# Altium schematic sheet Thermostat.SchDoc: Schématique Carte Thermostat
size A4; Date: 16/12/2024; Author: Randonnet Bertil; Revision: V1REVA; SheetNumber: 1; SheetTotal: 1
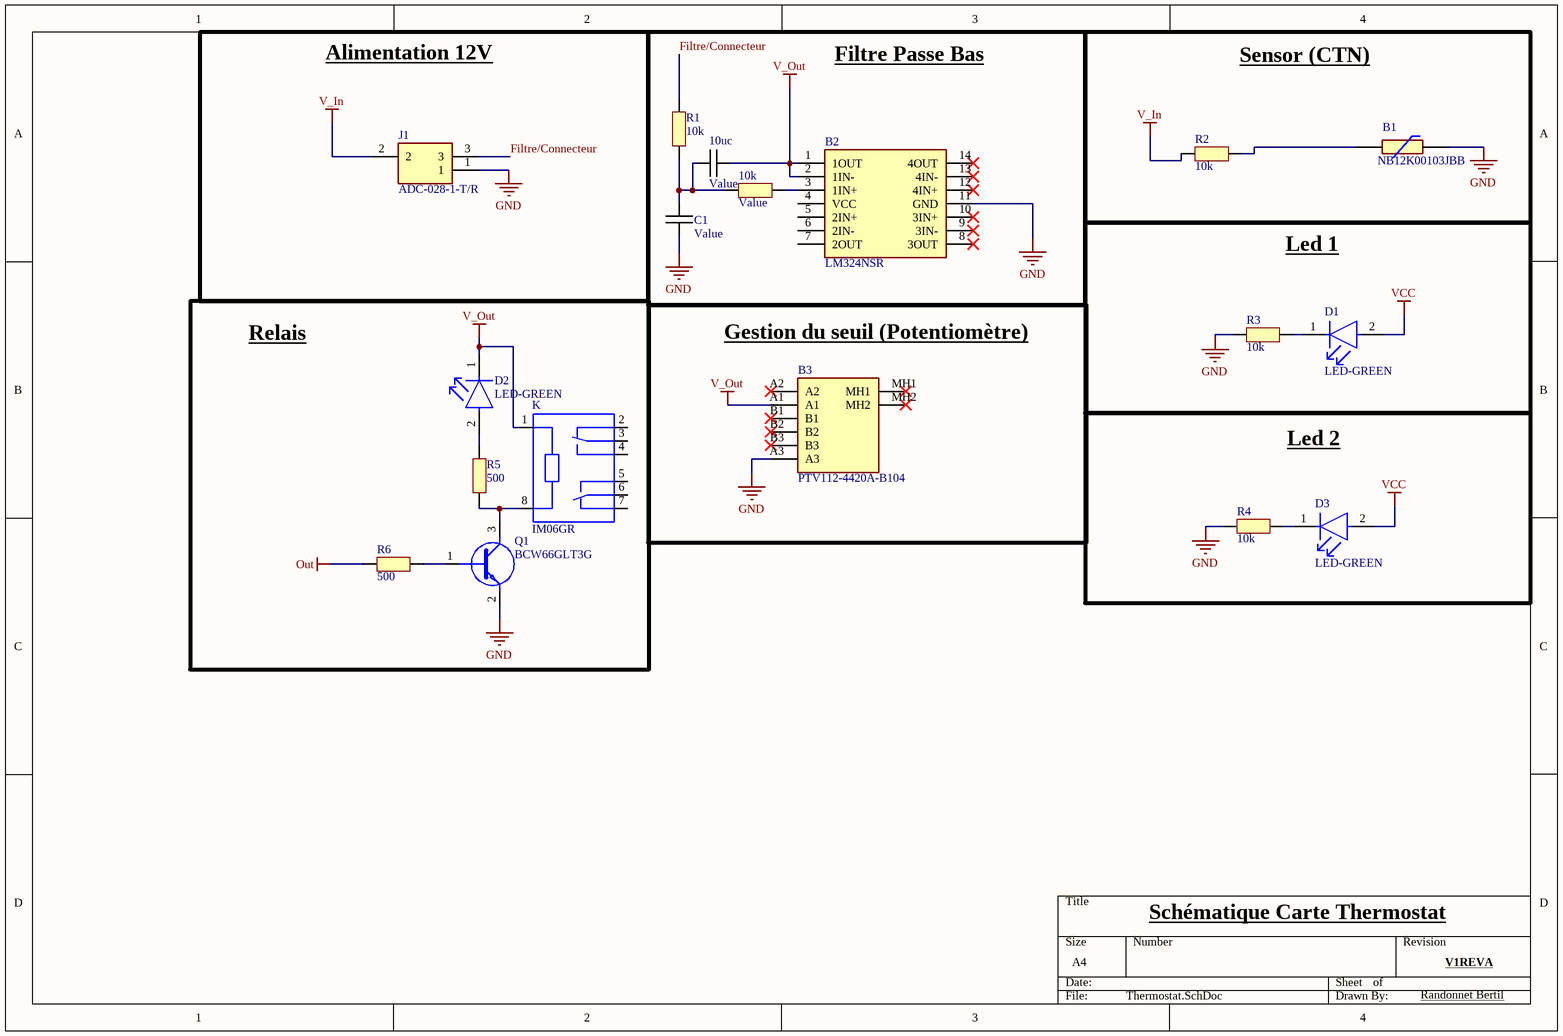
[diagram p0: Thermostat.SchDoc]

## Parts
10k  Value  [RESC1005X06N]
10uc  Value  [CAPC1005X06N]
B1  NB12K00103JBB  [RESC2212X50N]
B2  LM324NSR  [SOIC127P780X200-14N]
B3  PTV112-4420A-B104  [PTV1124420AB104]
C1  Value  [CAPC1005X06N]
D1  LED-GREEN  [SMD-1608-LED]
D2  LED-GREEN  [SMD-1608-LED]
D3  LED-GREEN  [SMD-1608-LED]
J1  ADC-028-1-T/R  [PJ1021SMTTR]
K  IM06GR  [RELAY_IM06GR]
Q1  BCW66GLT3G  [SOT96P237X111-3N]
R1  10k  [RESC1005X06N]
R2  10k  [RESC1005X06N]
R3  10k  [RESC1005X06N]
R4  10k  [RESC1005X06N]
R5  500  [RESC1005X06N]
R6  500  [RESC1005X06N]

## Blocks framed on the sheet
Alimentation 12V: J1
Filtre Passe Bas: 10k 10uc B2 C1 R1
Sensor (CTN): B1 R2
Led 1: D1 R3
Relais: D2 K Q1 R5 R6
Gestion du seuil (Potentiomètre): B3
Led 2: D3 R4

## Nets
GND: B1.1 B2.11(GND) B3.A3 C1.2 J1.1 Q1.2(E) R3.2 R4.2
Out: R6.2
V_In: J1.2 R2.1
V_Out: 10uc.2 B2.1(1OUT) B2.2(1IN-) B3.A1 D2.1(C) K.1
VCC: D1.2(A) D3.2(A)
Filtre/Connecteur: J1.3 R1.2
Net10k_1: 10k.1 10uc.1 C1.1 R1.1
Net10k_2: 10k.2 B2.3(1IN+)
NetB1_2: B1.2 R2.2
NetD1_1: D1.1(C) R3.1
NetD2_2: D2.2(A) R5.2
NetD3_1: D3.1(C) R4.1
NetK_8: K.8 Q1.3(C) R5.1
NetQ1_1: Q1.1(B) R6.1

Not connected (* = marked no-connect by the designer): B2 4(VCC) 5(2IN+) 6(2IN-) 7(2OUT) 8(3OUT)* 9(3IN-)* 10(3IN+)* 12(4IN+)* 13(4IN-)* 14(4OUT)*; B3 A2* B1* B2* B3* MH1* MH2*; K 2 3 4 5 6 7

## Library data of the parts
10k R1-R6 = Resistor
10uc C1 = Capacitor
B1 = NB12K00103JBB: NTC SMD Thermistor, NB12K, 10K, 5% AVX 10k 0805 Protection NTC Thermistor, 5s, 2 x 1.25 x 1.3mm; Manufacturer_Name: Kyocera AVX; Geometry.Height: 0.5mm; Manufacturer_Part_Number: NB12K00103JBB; Mouser Part Number: 581-NB12K00103JBB; Mouser Price/Stock: https://www.mouser.co.uk/ProductDetail/AVX/NB12K00103JBB/?qs=4%252B6%252BTdINQeDPvI%252BQUQjJ3Q%3D%3D; Arrow Part Number: NB12K00103JBB; Arrow Price/Stock: https://www.arrow.com/en/products/nb12k00103jbb/avx; Datasheet Link: https://datasheet.datasheetarchive.com/originals/distributors/Datasheets-DGA6/551314.pdf
B2 = LM324NSR: Quadruple Operational Amplifier; Manufacturer_Name: Texas Instruments; Geometry.Height: 2mm; Manufacturer_Part_Number: LM324NSR; Mouser Part Number: 595-LM324NSR; Mouser Price/Stock: https://www.mouser.co.uk/ProductDetail/Texas-Instruments/LM324NSR?qs=VBduBm9rCJQcjq4eh95DkA%3D%3D; Arrow Part Number: LM324NSR; Arrow Price/Stock: https://www.arrow.com/en/products/lm324nsr/texas-instruments?utm_currency=USD&region=nac; Datasheet Link: http://www.ti.com/lit/gpn/LM324
B3 = PTV112-4420A-B104: Potentiometers PANEL CONTROL 100kOhm; Manufacturer_Name: Bourns; Geometry.Height: 20.5mm; Manufacturer_Part_Number: PTV112-4420A-B104; Mouser Part Number: 652-PTV1124420AB104; Mouser Price/Stock: https://www.mouser.co.uk/ProductDetail/Bourns/PTV112-4420A-B104?qs=nqw9FAyaR8PT4wHHFlLdhA%3D%3D; Arrow Part Number: *; Arrow Price/Stock: *; Datasheet Link: https://www.bourns.com/docs/Product-Datasheets/PTVPTT.pdf
D1-D3 = LED-GREEN: LED GREEN CLEAR CHIP SMD LTST-C190GKT; Dominant Wavelength: 569nm; Reverse Voltage: 5V; Lens Color: Colorless; Viewing Angle: 130°; Voltage: 2V; Forward Current: 30mA; Power Dissipation: 100mW; Luminous Intensity: 6mcd; Number of LEDs: 1; Forward Voltage: 2.1V; Wavelength: 565nm; Test Current: 10mA; Min Operating Temperature: -55°C; Lens Style: Clear; Mount: Surface Mount; Width: 0.8mm; Packaging: Tape and Reel; Lens Transparency: Clear; Case Code (Metric): 1608; Depth: 0.8mm; Case Code (Imperial): 0603; Case/Package: 0603; Number of Pins: 2; Max Operating Temperature: 85°C; Lead Free: Lead Free; Number of Elements: 1; Length: 1.6mm; Height: 0.8mm; Package Quantity: 1; Power Rating: 100mW; Radiation Hardening: No; Illumination Color: Green; Color: Green
J1 = ADC-028-1-T/R: Connecteurs d'alimentation continue DC POWER JACK 2MM PIN TYPE 028; Manufacturer_Name: Same Sky; Geometry.Height: 6mm; Manufacturer_Part_Number: ADC-028-1-T/R; Mouser Part Number: 737-ADC-028-1-T/R; Mouser Price/Stock: https://www.mouser.fr/ProductDetail/Adam-Tech/ADC-028-1-T-R?qs=TTVbHWoAP%2FSiqsZeR9Co0Q%3D%3D
K = IM06GR: Electromechanical Relay 12VDC 1.029KOhm 2A DPDT _10x7.5x5.65_mm SMD Signal Relay; MF: TE Connectivity; Package: None; Availability: Unavailable; TE_purchase_URL: https://www.te.com/usa-en/product-2-1462037-3.html?te_bu=Cor&te_type=disp&te_campaign=seda_glo_cor-seda-global-disp-prtnr-fy19-seda-model-bom-cta_sma-317_1&elqCampaignId=32493; Value: *; MP: IM06GR; SnapEDA_Link: https://www.snapeda.com/parts/IM06GR/TE%20Connectivity%20Potter%20%26%20Brumfield%20Relays/view-part/264147/?ref=snap; Price: None
Q1 = BCW66GLT3G: NPN Bipolar Transistor; Manufacturer_Name: onsemi; Geometry.Height: 1.11mm; Manufacturer_Part_Number: BCW66GLT3G; Mouser Part Number: 863-BCW66GLT3G; Mouser Price/Stock: https://www.mouser.co.uk/ProductDetail/onsemi/BCW66GLT3G?qs=XfkxeqX9xWXeTiewInI3Nw%3D%3D; Arrow Part Number: BCW66GLT3G; Arrow Price/Stock: https://www.arrow.com/en/products/bcw66glt3g/on-semiconductor?region=europe; Datasheet Link: http://www.onsemi.com/pub/Collateral/BCW66GLT1-D.PDF